# Altium project POWER MANAGEMENT V2.PrjPcb
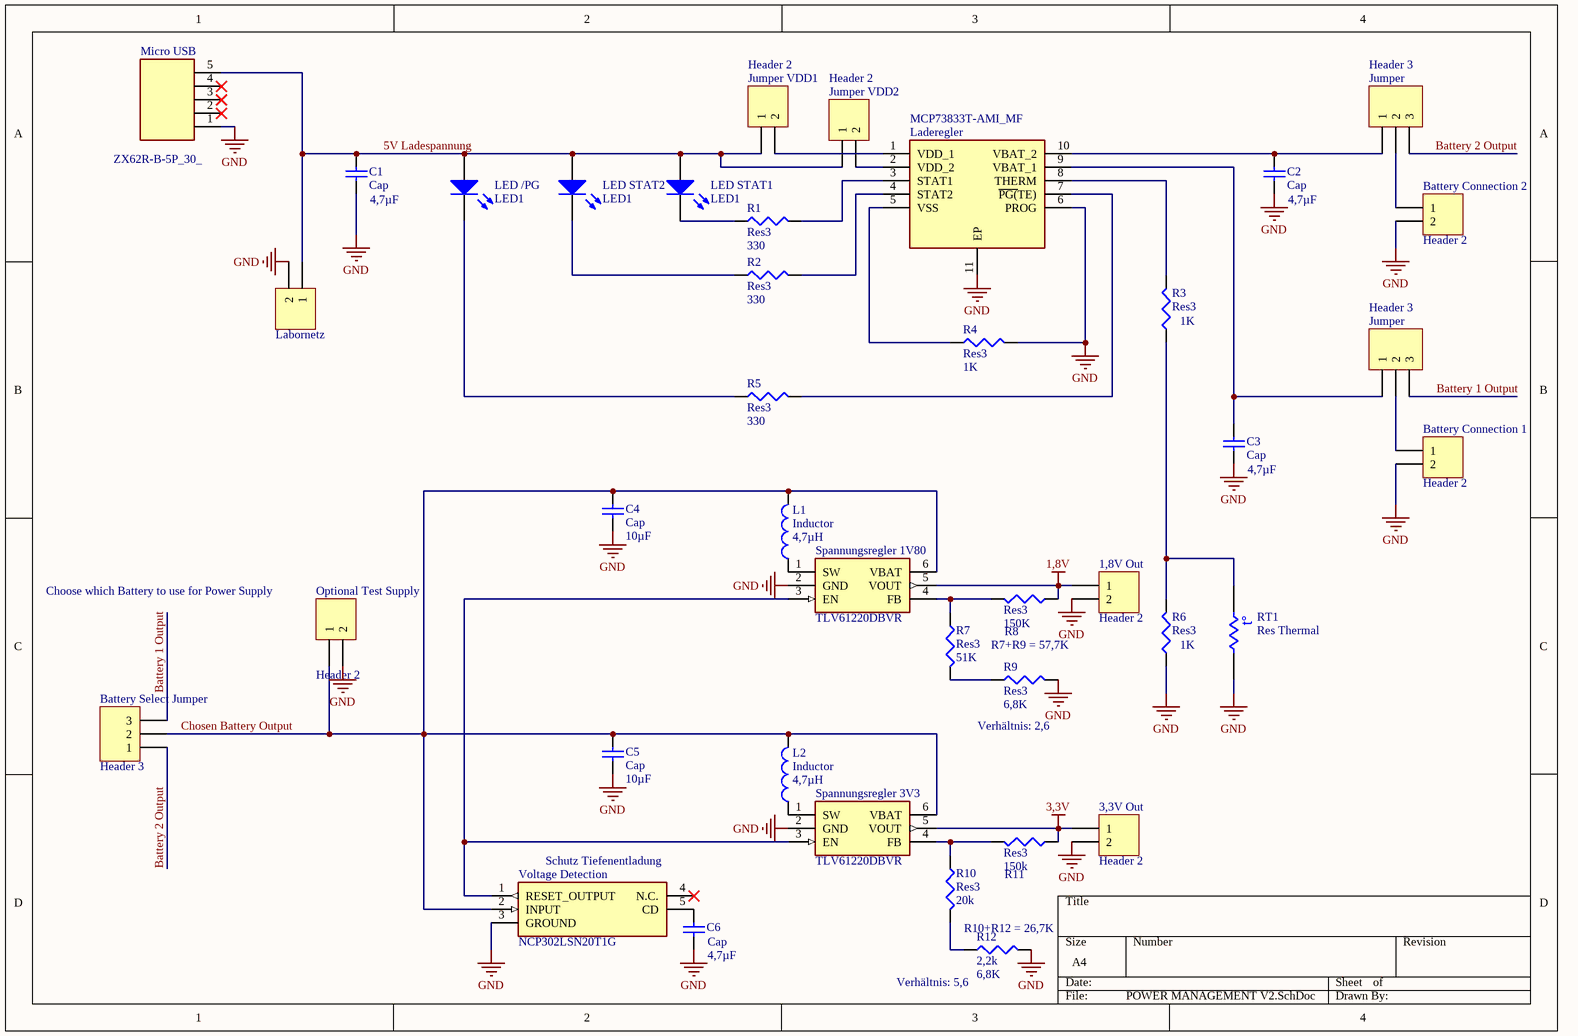
[diagram p0: POWER MANAGEMENT V2.SchDoc]
1 sheet, 40 parts. Net scope: global (net labels, ports and power ports of the same name join across sheets).
Board file: POWER MANAGEMENT V2.PcbDoc

## Sheet POWER MANAGEMENT V2.SchDoc
size A4

### Parts
(Parts that share a designator on the sheet are numbered #1, #2 ... from top to bottom, then left to right.)
1,8V_Out  Header 2  [HDR1X2]
3,3V_Out  Header 2  [HDR1X2]
Battery_Connection_1  Header 2  [HDR1X2]
Battery_Connection_2  Header 2  [HDR1X2]
Battery_Select_Jumper  Header 3  [HDR1X3]
C1  Cap  value 4,7µF  [1608[0603]]
C2  Cap  value 4,7µF  [1608[0603]]
C3  Cap  value 4,7µF  [1608[0603]]
C4  Cap  value 10µF  [1608[0603]]
C5  Cap  value 10µF  [1608[0603]]
C6  Cap  value 4,7µF  [1608[0603]]
Jumper#1  Header 3  [HDR1X3]
Jumper#2  Header 3  [HDR1X3]
Jumper_VDD1  Header 2  [HDR1X2]
Jumper_VDD2  Header 2  [HDR1X2]
L1  Inductor  value 4,7µH  [INDC4532]
L2  Inductor  value 4,7µH  [INDC4532]
Labornetz  (no value)  [HDR1X2]
Laderegler  MCP73833T-AMI_MF  [SON50P300X300X100-11N-D]
LED_/PG  LED1  [1608[0603]]
LED_STAT1  LED1  [1608[0603]]
LED_STAT2  LED1  [1608[0603]]
Micro_USB  ZX62R-B-5P_30_  [ZX62R-B-5P(30)]
Optional_Test_Supply  Header 2  [HDR1X2]
R1  Res3  value 330  [6-0805_N]
R2  Res3  value 330  [6-0805_N]
R3  Res3  value 1K  [6-0805_M]
R4  Res3  value 1K  [6-0805_N]
R5  Res3  value 330  [6-0805_N]
R6  Res3  value 1K  [6-0805_M]
R7  Res3  value 51K  [6-0805_M]
R8  Res3  value 150K  [6-0805_M]
R9  Res3  value 6,8K  [6-0805_M]
R10  Res3  value 20k  [6-0805_M]
R11  Res3  value 150k  [6-0805_M]
R12  2,2k  value 6,8K  [6-0805_M]
RT1  Res Thermal  [6-0805_L]
Spannungsregler_1V80  TLV61220DBVR  [SOT95P280X145-6N]
Spannungsregler_3V3  TLV61220DBVR  [SOT95P280X145-6N]
Voltage_Detection  NCP302LSN20T1G  [SOT95P275X110-5N]

### Nets
1,8V: 1,8V_Out.1 R8.1 Spannungsregler_1V80.5(VOUT)
3,3V: 3,3V_Out.1 R11.1 Spannungsregler_3V3.5(VOUT)
GND: 1,8V_Out.2 3,3V_Out.2 Battery_Connection_1.2 Battery_Connection_2.2 C1.1 C2.1 C3.1 C4.2 C5.2 C6.1 Labornetz.2 Laderegler.6(PROG) Laderegler.11(EP) Micro_USB.1 Optional_Test_Supply.2 R4.2 R6.1 R9.2 R12.2 RT1.2 Spannungsregler_1V80.2(GND) Spannungsregler_3V3.2(GND) Voltage_Detection.3(GROUND)
5V Ladespannung: C1.2 Jumper_VDD1.1 Jumper_VDD2.1 Labornetz.1 LED_/PG.1(A) LED_STAT1.1(A) LED_STAT2.1(A) Micro_USB.5
Battery 1 Output: Battery_Select_Jumper.3 Jumper#2.3
Battery 2 Output: Battery_Select_Jumper.1 Jumper#1.3
Chosen Battery Output: Battery_Select_Jumper.2 C4.1 C5.1 L1.2 L2.2 Optional_Test_Supply.1 Spannungsregler_1V80.6(VBAT) Spannungsregler_3V3.6(VBAT) Voltage_Detection.2(INPUT)
NetBattery_Connection_1_1: Battery_Connection_1.1 Jumper#2.2
NetBattery_Connection_2_1: Battery_Connection_2.1 Jumper#1.2
NetC2_2: C2.2 Jumper#1.1 Laderegler.10(VBAT_2)
NetC3_2: C3.2 Jumper#2.1 Laderegler.9(VBAT_1)
NetC6_2: C6.2 Voltage_Detection.5(CD)
NetJumper_VDD1_2: Jumper_VDD1.2 Laderegler.1(VDD_1)
NetJumper_VDD2_2: Jumper_VDD2.2 Laderegler.2(VDD_2)
NetL1_1: L1.1 Spannungsregler_1V80.1(SW)
NetL2_1: L2.1 Spannungsregler_3V3.1(SW)
NetLaderegler_3: Laderegler.3(STAT1) R1.2
NetLaderegler_4: Laderegler.4(STAT2) R2.2
NetLaderegler_5: Laderegler.5(VSS) R4.1
NetLaderegler_7: Laderegler.7(~{PG(}TE)) R5.2
NetLaderegler_8: Laderegler.8(THERM) R3.2
NetLED_/PG_2: LED_/PG.2(K) R5.1
NetLED_STAT1_2: LED_STAT1.2(K) R1.1
NetLED_STAT2_2: LED_STAT2.2(K) R2.1
NetR3_1: R3.1 R6.2 RT1.1
NetR7_1: R7.1 R8.2 Spannungsregler_1V80.4(FB)
NetR7_2: R7.2 R9.1
NetR10_1: R10.1 R11.2 Spannungsregler_3V3.4(FB)
NetR10_2: R10.2 R12.1
NetSpannungsregler_1V80_3: Spannungsregler_1V80.3(EN) Spannungsregler_3V3.3(EN) Voltage_Detection.1(RESET_OUTPUT)

Not connected (* = marked no-connect by the designer): Micro_USB 2* 3* 4*; Voltage_Detection 4(N.C.)*

### Notes on the sheet
- (near Optional_Test_Supply) Choose which Battery to use for Power Supply
- R7+R9 = 57,7K
- Verhältnis: 2,6
- (near Voltage_Detection) Schutz Tiefenentladung
- (near R12) Verhältnis: 5,6
- R10+R12 = 26,7K
- (in symbol Res Thermal) t°

### Library data of the parts
1,8V_Out 3,3V_Out Battery_Connection_1 Battery_Connection_2 Jumper_VDD1 Jumper_VDD2 Labornetz Optional_Test_Supply = Header 2: Header, 2-Pin; LatestRevisionDate: 17-Jul-2002; LatestRevisionNote: Re-released for DXP Platform.; Publisher: Altium Limited
Battery_Select_Jumper Jumper#1 Jumper#2 = Header 3: Header, 3-Pin; LatestRevisionDate: 17-Jul-2002; LatestRevisionNote: Re-released for DXP Platform.; Publisher: Altium Limited
C1-C6 = Cap: Capacitor; Published: 8-Jun-2000; LatestRevisionDate: 17-Jul-2002; LatestRevisionNote: Re-released for DXP Platform.; PackageReference: RAD-0.3; Publisher: Altium Limited; PackageDescription: Radial Cap, Thru-Hole; 2 Leads; 0.3 in Pin Spacing
L1 L2 = Inductor: Code_IEC: 1005; Published: 8-Jun-2000; LatestRevisionDate: 29-May-2009; LatestRevisionNote: IPC-7351 Footprint Added.; PackageReference: 0402-A; Publisher: Altium Limited; PackageDescription: Chip Inductor; Code_JEITA: 0402
Laderegler = MCP73833T-AMI_MF: Integrated Circuit; Manufacturer_Name: Microchip; Manufacturer_Part_Number: MCP73833T-AMI/MF; Datasheet Link: https://componentsearchengine.com//MCP73833T-AMI_MF.pdf; Height: 1mm; Mouser2 Part Number: 579-MCP73833T-AMI/MF; Mouser2 Price/Stock: https://www.mouser.com/Search/Refine.aspx?Keyword=579-MCP73833T-AMI%2FMF
LED_/PG LED_STAT1 LED_STAT2 = LED1: Typical RED GaAs LED; Published: 8-Jun-2000; LatestRevisionDate: 08-Jul-2005; LatestRevisionNote: Mech Layer 1 removed.; PackageReference: LED-1; Publisher: Altium Limited; PackageDescription: LED; 2 Leads
Micro_USB = ZX62R-B-5P_30_: Connector; Manufacturer_Name: Hirose; Manufacturer_Part_Number: ZX62R-B-5P(30)
R1-R12 = Res3: Resistor; Published: 8-Jun-2000; LatestRevisionDate: 29-May-2009; LatestRevisionNote: IPC-7351 Footprint Added.; PackageReference: J1-0603; Publisher: Altium Limited; PackageDescription: Chip Resistor
RT1 = Res Thermal: Thermistor; Published: 24-Mar-1999; LatestRevisionDate: 29-May-2009; LatestRevisionNote: IPC-7351 Footprint Added.; PackageVersion: Mar-2003; PackageReference: 6-0805; Publisher: Altium Limited; PackageDescription: Chip Resistor 0805 Case Size; Code_IPC: RESC2012
Spannungsregler_1V80 Spannungsregler_3V3 = TLV61220DBVR: Integrated Circuit; Manufacturer_Name: Texas Instruments; Datasheet Link: http://www.ti.com/lit/gpn/tlv61220; Height: 1.45mm; Mouser2 Part Number: 595-TLV61220DBVR; Mouser2 Price/Stock: https://www.mouser.com/Search/Refine.aspx?Keyword=595-TLV61220DBVR; Manufacturer_Part_Number: TLV61220DBVR
Voltage_Detection = NCP302LSN20T1G: Integrated Circuit; Manufacturer_Name: ON Semiconductor; Datasheet Link: http://www.onsemi.com/pub/Collateral/NCP302-D.PDF; Height: 1.1mm; Manufacturer_Part_Number: NCP302LSN20T1G